# EAGLE design LE1-4 (EAGLE 8.5.1)
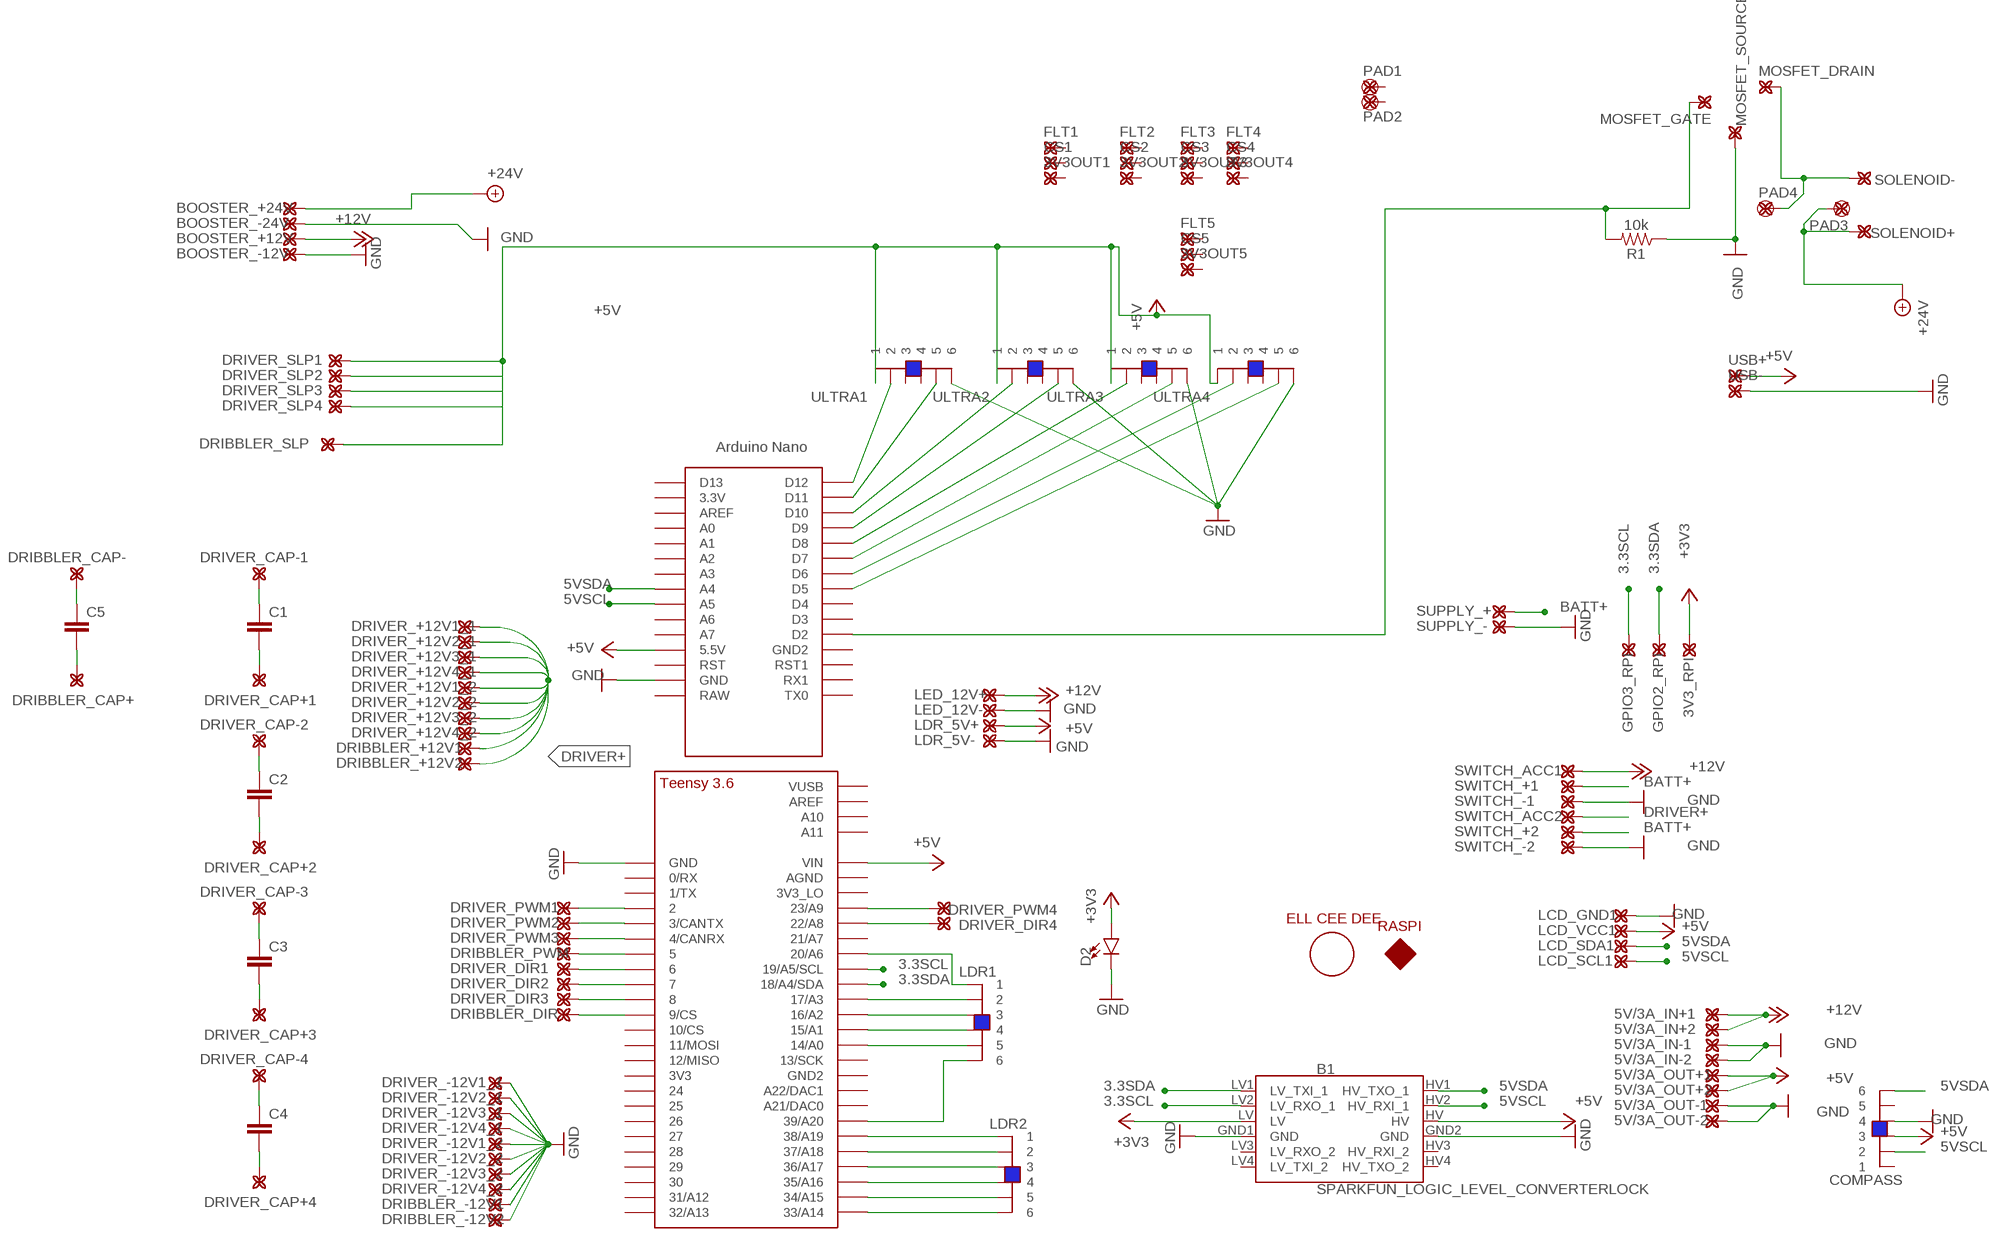
[diagram p0: schematic, sheet 1]

## Parts
3V3_RPI  BETTERPAD_2.54  [SUPERIORSIM]
3V3OUT1  BETTERPAD_2.54  [SUPERIORSIM]
3V3OUT2  BETTERPAD_2.54  [SUPERIORSIM]
3V3OUT3  BETTERPAD_2.54  [SUPERIORSIM]
3V3OUT4  BETTERPAD_2.54  [SUPERIORSIM]
3V3OUT5  BETTERPAD_2.54  [SUPERIORSIM]
5V/3A_IN+1  BETTERPAD_2.54  [SUPERIORSIM]
5V/3A_IN+2  BETTERPAD_2.54  [SUPERIORSIM]
5V/3A_IN-1  BETTERPAD_2.54  [SUPERIORSIM]
5V/3A_IN-2  BETTERPAD_2.54  [SUPERIORSIM]
5V/3A_OUT+1  BETTERPAD_2.54  [SUPERIORSIM]
5V/3A_OUT+2  BETTERPAD_2.54  [SUPERIORSIM]
5V/3A_OUT-1  BETTERPAD_2.54  [SUPERIORSIM]
5V/3A_OUT-2  BETTERPAD_2.54  [SUPERIORSIM]
B1  SPARKFUN_LOGIC_LEVEL_CONVERTERLOCK  [SPARKFUN_LOGIC_LEVEL_CONVERTER_LOCK]
BOOSTER_+12V  BETTERPAD_2.54  [SUPERIORSIM]
BOOSTER_+24V  BETTERPAD_2.54  [SUPERIORSIM]
BOOSTER_-12V  BETTERPAD_2.54  [SUPERIORSIM]
BOOSTER_-24V  BETTERPAD_2.54  [SUPERIORSIM]
C1  C5/7.2  [C5B7.2]
C2  C5/7.2  [C5B7.2]
C3  C5/7.2  [C5B7.2]
C4  C5/7.2  [C5B7.2]
C5  C5/7.2  [C5B7.2]
COMPASS  6P6C_FEMALESMD  [6P6C_FEMALE]
CS1  BETTERPAD_2.54  [SUPERIORSIM]
CS2  BETTERPAD_2.54  [SUPERIORSIM]
CS3  BETTERPAD_2.54  [SUPERIORSIM]
CS4  BETTERPAD_2.54  [SUPERIORSIM]
CS5  BETTERPAD_2.54  [SUPERIORSIM]
D2  LED-3MM-NO_SILK  [LED_3MM-NS]
DRIBBLER_+12V1  BETTERPAD_2.54  [SUPERIORSIM]
DRIBBLER_+12V2  BETTERPAD_2.54  [SUPERIORSIM]
DRIBBLER_-12V1  BETTERPAD_2.54  [SUPERIORSIM]
DRIBBLER_-12V2  BETTERPAD_2.54  [SUPERIORSIM]
DRIBBLER_CAP+  BETTERPAD_2.54  [SUPERIORSIM]
DRIBBLER_CAP-  BETTERPAD_2.54  [SUPERIORSIM]
DRIBBLER_DIR  BETTERPAD_2.54  [SUPERIORSIM]
DRIBBLER_PWM  BETTERPAD_2.54  [SUPERIORSIM]
DRIBBLER_SLP  BETTERPAD_2.54  [SUPERIORSIM]
DRIVER_+12V1_1  BETTERPAD_2.54  [SUPERIORSIM]
DRIVER_+12V1_2  BETTERPAD_2.54  [SUPERIORSIM]
DRIVER_+12V2_1  BETTERPAD_2.54  [SUPERIORSIM]
DRIVER_+12V2_2  BETTERPAD_2.54  [SUPERIORSIM]
DRIVER_+12V3_1  BETTERPAD_2.54  [SUPERIORSIM]
DRIVER_+12V3_2  BETTERPAD_2.54  [SUPERIORSIM]
DRIVER_+12V4_1  BETTERPAD_2.54  [SUPERIORSIM]
DRIVER_+12V4_2  BETTERPAD_2.54  [SUPERIORSIM]
DRIVER_-12V1_1  BETTERPAD_2.54  [SUPERIORSIM]
DRIVER_-12V1_2  BETTERPAD_2.54  [SUPERIORSIM]
DRIVER_-12V2_1  BETTERPAD_2.54  [SUPERIORSIM]
DRIVER_-12V2_2  BETTERPAD_2.54  [SUPERIORSIM]
DRIVER_-12V3_1  BETTERPAD_2.54  [SUPERIORSIM]
DRIVER_-12V3_2  BETTERPAD_2.54  [SUPERIORSIM]
DRIVER_-12V4_1  BETTERPAD_2.54  [SUPERIORSIM]
DRIVER_-12V4_2  BETTERPAD_2.54  [SUPERIORSIM]
DRIVER_CAP+1  BETTERPAD_2.54  [SUPERIORSIM]
DRIVER_CAP+2  BETTERPAD_2.54  [SUPERIORSIM]
DRIVER_CAP+3  BETTERPAD_2.54  [SUPERIORSIM]
DRIVER_CAP+4  BETTERPAD_2.54  [SUPERIORSIM]
DRIVER_CAP-1  BETTERPAD_2.54  [SUPERIORSIM]
DRIVER_CAP-2  BETTERPAD_2.54  [SUPERIORSIM]
DRIVER_CAP-3  BETTERPAD_2.54  [SUPERIORSIM]
DRIVER_CAP-4  BETTERPAD_2.54  [SUPERIORSIM]
DRIVER_DIR1  BETTERPAD_2.54  [SUPERIORSIM]
DRIVER_DIR2  BETTERPAD_2.54  [SUPERIORSIM]
DRIVER_DIR3  BETTERPAD_2.54  [SUPERIORSIM]
DRIVER_DIR4  BETTERPAD_2.54  [SUPERIORSIM]
DRIVER_PWM1  BETTERPAD_2.54  [SUPERIORSIM]
DRIVER_PWM2  BETTERPAD_2.54  [SUPERIORSIM]
DRIVER_PWM3  BETTERPAD_2.54  [SUPERIORSIM]
DRIVER_PWM4  BETTERPAD_2.54  [SUPERIORSIM]
DRIVER_SLP1  BETTERPAD_2.54  [SUPERIORSIM]
DRIVER_SLP2  BETTERPAD_2.54  [SUPERIORSIM]
DRIVER_SLP3  BETTERPAD_2.54  [SUPERIORSIM]
DRIVER_SLP4  BETTERPAD_2.54  [SUPERIORSIM]
FLT1  BETTERPAD_2.54  [SUPERIORSIM]
FLT2  BETTERPAD_2.54  [SUPERIORSIM]
FLT3  BETTERPAD_2.54  [SUPERIORSIM]
FLT4  BETTERPAD_2.54  [SUPERIORSIM]
FLT5  BETTERPAD_2.54  [SUPERIORSIM]
GPIO2_RPI  BETTERPAD_2.54  [SUPERIORSIM]
GPIO3_RPI  BETTERPAD_2.54  [SUPERIORSIM]
LCD1  LCD-16X2SILK  [LCD-16X2]
LCD_GND1  BETTERPAD_2.54  [SUPERIORSIM]
LCD_SCL1  BETTERPAD_2.54  [SUPERIORSIM]
LCD_SDA1  BETTERPAD_2.54  [SUPERIORSIM]
LCD_VCC1  BETTERPAD_2.54  [SUPERIORSIM]
LDR1  6P6C_FEMALESMD  [6P6C_FEMALE]
LDR2  6P6C_FEMALESMD  [6P6C_FEMALE]
LDR_5V+  BETTERPAD_2.54  [SUPERIORSIM]
LDR_5V-  BETTERPAD_2.54  [SUPERIORSIM]
LED_12V+  BETTERPAD_2.54  [SUPERIORSIM]
LED_12V-  BETTERPAD_2.54  [SUPERIORSIM]
MOSFET_DRAIN  BETTERPAD_2.54  [SUPERIORSIM]
MOSFET_GATE  BETTERPAD_2.54  [SUPERIORSIM]
MOSFET_SOURCE  BETTERPAD_2.54  [SUPERIORSIM]
PAD1  BETTERPAD_2.54/1.5  [1,5]
PAD2  BETTERPAD_2.54/1.5  [1,5]
PAD3  BETTERPAD_2.54/1.5  [1,5]
PAD4  BETTERPAD_2.54/1.5  [1,5]
PCB1  RPI3  [RPI3]
R1  10k  10KOHM-HORIZ-1/4W-1%  [AXIAL-0.3]
SOLENOID+  BETTERPAD_2.54  [SUPERIORSIM]
SOLENOID-  BETTERPAD_2.54  [SUPERIORSIM]
SUPPLY_+  BETTERPAD_2.54  [SUPERIORSIM]
SUPPLY_-  BETTERPAD_2.54  [SUPERIORSIM]
SWITCH_+1  BETTERPAD_2.54  [SUPERIORSIM]
SWITCH_+2  BETTERPAD_2.54  [SUPERIORSIM]
SWITCH_-1  BETTERPAD_2.54  [SUPERIORSIM]
SWITCH_-2  BETTERPAD_2.54  [SUPERIORSIM]
SWITCH_ACC1  BETTERPAD_2.54  [SUPERIORSIM]
SWITCH_ACC2  BETTERPAD_2.54  [SUPERIORSIM]
U$1  TEENSY_3.5/3.6_BASIC  [TEENSY_3.5/3.6_BASIC]
U$2  NANO  [NANO]
ULTRA1  6P6C_FEMALESMD  [6P6C_FEMALE]
ULTRA2  6P6C_FEMALESMD  [6P6C_FEMALE]
ULTRA3  6P6C_FEMALESMD  [6P6C_FEMALE]
ULTRA4  6P6C_FEMALESMD  [6P6C_FEMALE]
USB+  BETTERPAD_2.54  [SUPERIORSIM]
USB-  BETTERPAD_2.54  [SUPERIORSIM]

## Nets
3.3SCL: B1.LV2(LV_RXO_1) GPIO3_RPI..(P) U$1.19/A5/SCL
3.3SDA: B1.LV1(LV_TXI_1) GPIO2_RPI..(P) U$1.18/A4/SDA
5VSCL: B1.HV2(HV_RXI_1) COMPASS.2 LCD_SCL1..(P) U$2.A5
5VSDA: B1.HV1(HV_TXO_1) COMPASS.6 LCD_SDA1..(P) U$2.A4
+3V3: 3V3_RPI..(P) B1.LV D2.A
+5V: 5V/3A_OUT+1..(P) 5V/3A_OUT+2..(P) B1.HV COMPASS.3 DRIBBLER_SLP..(P) DRIVER_SLP1..(P) DRIVER_SLP2..(P) DRIVER_SLP3..(P) DRIVER_SLP4..(P) LCD_VCC1..(P) LDR_5V+..(P) U$1.VIN U$2.5V(5.5V) ULTRA1.1 ULTRA2.1 ULTRA3.1 ULTRA4.1 USB+..(P)
+12V: 5V/3A_IN+1..(P) 5V/3A_IN+2..(P) BOOSTER_+12V..(P) LED_12V+..(P) SWITCH_ACC1..(P)
+24V: BOOSTER_+24V..(P) PAD3.P$1(P) SOLENOID+..(P)
BATT+: SUPPLY_+..(P) SWITCH_+1..(P) SWITCH_+2..(P)
DRIVER+: DRIBBLER_+12V1..(P) DRIBBLER_+12V2..(P) DRIVER_+12V1_1..(P) DRIVER_+12V1_2..(P) DRIVER_+12V2_1..(P) DRIVER_+12V2_2..(P) DRIVER_+12V3_1..(P) DRIVER_+12V3_2..(P) DRIVER_+12V4_1..(P) DRIVER_+12V4_2..(P) SWITCH_ACC2..(P)
GND: 5V/3A_IN-1..(P) 5V/3A_IN-2..(P) 5V/3A_OUT-1..(P) 5V/3A_OUT-2..(P) B1.GND1(GND) B1.GND2(GND) BOOSTER_-12V..(P) BOOSTER_-24V..(P) COMPASS.4 D2.K(C) DRIBBLER_-12V1..(P) DRIBBLER_-12V2..(P) DRIVER_-12V1_1..(P) DRIVER_-12V1_2..(P) DRIVER_-12V2_1..(P) DRIVER_-12V2_2..(P) DRIVER_-12V3_1..(P) DRIVER_-12V3_2..(P) DRIVER_-12V4_1..(P) DRIVER_-12V4_2..(P) LCD_GND1..(P) LDR_5V-..(P) LED_12V-..(P) MOSFET_SOURCE..(P) R1.P$1 SUPPLY_-..(P) SWITCH_-1..(P) SWITCH_-2..(P) U$1.GND U$2.GND ULTRA1.6 ULTRA2.6 ULTRA3.6 ULTRA4.6 USB-..(P)
N$1: LDR1.6 U$1.39/A20
N$2: DRIBBLER_DIR..(P) U$1.9/CS
N$3: DRIBBLER_PWM..(P) U$1.5
N$4: DRIVER_PWM1..(P) U$1.2
N$5: DRIVER_PWM2..(P) U$1.3/CANTX
N$6: LDR1.2 U$1.17/A3
N$7: LDR1.3 U$1.16/A2
N$8: LDR1.4 U$1.15/A1
N$9: LDR1.5 U$1.14/A0
N$10: LDR1.1 U$1.20/A6
N$11: DRIVER_PWM3..(P) U$1.4/CANRX
N$12: MOSFET_DRAIN..(P) PAD4.P$1(P) SOLENOID-..(P)
N$13: MOSFET_GATE..(P) R1.P$2 U$2.D2
N$14: DRIVER_PWM4..(P) U$1.23/A9
N$15: DRIVER_DIR4..(P) U$1.22/A8
N$16: C5.1 DRIBBLER_CAP-..(P)
N$17: DRIVER_DIR1..(P) U$1.6
N$18: LDR2.1 U$1.38/A19
N$19: LDR2.2 U$1.37/A18
N$20: LDR2.3 U$1.36/A17
N$21: LDR2.4 U$1.35/A16
N$22: LDR2.5 U$1.34/A15
N$23: LDR2.6 U$1.33/A14
N$24: DRIVER_DIR2..(P) U$1.7
N$25: DRIVER_DIR3..(P) U$1.8
N$26: U$2.D12 ULTRA1.2
N$27: C5.2 DRIBBLER_CAP+..(P)
N$28: U$2.D11 ULTRA1.5
N$29: U$2.D10 ULTRA2.2
N$30: U$2.D9 ULTRA2.5
N$31: C1.1 DRIVER_CAP-1..(P)
N$32: C1.2 DRIVER_CAP+1..(P)
N$33: C2.1 DRIVER_CAP-2..(P)
N$34: C2.2 DRIVER_CAP+2..(P)
N$35: C3.1 DRIVER_CAP-3..(P)
N$36: C3.2 DRIVER_CAP+3..(P)
N$37: C4.1 DRIVER_CAP-4..(P)
N$38: C4.2 DRIVER_CAP+4..(P)
N$39: U$2.D8 ULTRA3.2
N$40: U$2.D7 ULTRA3.5
N$41: U$2.D6 ULTRA4.2
N$42: U$2.D5 ULTRA4.5
Unconnected: 3V3OUT1..(P) 3V3OUT2..(P) 3V3OUT3..(P) 3V3OUT4..(P) 3V3OUT5..(P) B1.HV3(HV_RXI_2) B1.HV4(HV_TXO_2) B1.LV3(LV_RXO_2) B1.LV4(LV_TXI_2) COMPASS.1 COMPASS.5 CS1..(P) CS2..(P) CS3..(P) CS4..(P) CS5..(P) FLT1..(P) FLT2..(P) FLT3..(P) FLT4..(P) FLT5..(P) PAD1.P$1(P) PAD2.P$1(P) U$1.0/RX U$1.1/TX U$1.3V3 U$1.3V3_LO U$1.10/CS U$1.11/MOSI U$1.12/MISO U$1.13/SCK U$1.21/A7 U$1.21/DAC0(A21/DAC0) U$1.24 U$1.25 U$1.26 U$1.27 U$1.28 U$1.29 U$1.30 U$1.31/A12 U$1.32/A13 U$1.A10 U$1.A11 U$1.A22/DAC1 U$1.AGND U$1.AREF U$1.GND2 U$1.VUSB U$2.3.3V U$2.A0 U$2.A1 U$2.A2 U$2.A3 U$2.A6 U$2.A7 U$2.AREF U$2.D3 U$2.D4 U$2.D13 U$2.GND1(GND2) U$2.RAW U$2.RST U$2.RST1 U$2.RX1 U$2.TX0 ULTRA1.3 ULTRA1.4 ULTRA2.3 ULTRA2.4 ULTRA3.3 ULTRA3.4 ULTRA4.3 ULTRA4.4

## Library data of the parts
3V3_RPI 3V3OUT1-3V3OUT5 5V/3A_IN+1 5V/3A_IN+2 5V/3A_IN-1 5V/3A_IN-2 5V/3A_OUT+1 5V/3A_OUT+2 5V/3A_OUT-1 5V/3A_OUT-2 BOOSTER_+12V BOOSTER_+24V BOOSTER_-12V BOOSTER_-24V CS1-CS5 DRIBBLER_+12V1 DRIBBLER_+12V2 DRIBBLER_-12V1 DRIBBLER_-12V2 DRIBBLER_CAP+ DRIBBLER_CAP- DRIBBLER_DIR DRIBBLER_PWM DRIBBLER_SLP DRIVER_+12V1_1 DRIVER_+12V1_2 DRIVER_+12V2_1 DRIVER_+12V2_2 DRIVER_+12V3_1 DRIVER_+12V3_2 DRIVER_+12V4_1 DRIVER_+12V4_2 DRIVER_-12V1_1 DRIVER_-12V1_2 DRIVER_-12V2_1 DRIVER_-12V2_2 DRIVER_-12V3_1 DRIVER_-12V3_2 DRIVER_-12V4_1 DRIVER_-12V4_2 DRIVER_CAP+1-DRIVER_CAP+4 DRIVER_CAP-1-DRIVER_CAP-4 DRIVER_DIR1-DRIVER_DIR4 DRIVER_PWM1-DRIVER_PWM4 DRIVER_SLP1-DRIVER_SLP4 FLT1-FLT5 GPIO2_RPI GPIO3_RPI LCD_GND1 LCD_SCL1 LCD_SDA1 LCD_VCC1 LDR_5V+ LDR_5V- LED_12V+ LED_12V- MOSFET_DRAIN MOSFET_GATE MOSFET_SOURCE SOLENOID+ SOLENOID- SUPPLY_+ SUPPLY_- SWITCH_+1 SWITCH_+2 SWITCH_-1 SWITCH_-2 SWITCH_ACC1 SWITCH_ACC2 USB+ USB- = Yijiano:BETTERPAD_2.54
B1 = SparkFun-Boards:SPARKFUN_LOGIC_LEVEL_CONVERTER: SparkFun Logic Level Converter -Bi-Directional This is the mechnical outline for the 3.3V - 5V bi directional logic level converter. *Note, the "LOCK" Package has the header pins staggered by an offset of 5 mils (off center line), so that when you slide a row of standard 0.1" headers into the PTH pads, it will hold position vertically. See the follwing turorial for more information on this type of special footprints: Sneaky Footprints <https://www.sparkfun.com/tutorials/114> SparkFun Products: SparkFun Logic Level Converter - Bi-Directional <https://www.sparkfun.com/products/12009>
C1-C5 = capacitor-wima:C: CAPACITOR naming: grid - package width
COMPASS LDR1 LDR2 ULTRA1-ULTRA4 = Yijiano:6P6C_FEMALE
D2 = SparkFun-LED:LED: LED (Generic) Standard schematic elements and footprints for 5mm, 3mm, 1206, and 0603 sized LEDs. Generic LEDs with no color specified.
LCD1 = SparkFun-Displays:LCD-16X2: Standard text-only 16x2 parallel input LCD Basic 16 character by 2 line display. Typically utilizes the extremely common HD44780 parallel interface chipset SparkFun Products: Basic 16x2 Green <https://www.sparkfun.com/products/255> Basic 8x2 Green <https://www.sparkfun.com/products/11122>; SF_ID: LCD-00255
PAD1-PAD4 = Yijiano:BETTERPAD_2.54/1.5
PCB1 = e14_Rpi3_RevA:RPI3: Device for Raspberry Pi 3 board created by Dave Young for www.element14.com More information and support community is available at https://www.element14.com/community/community/raspberry-pi
R1 = SparkFun-Resistors:10KOHM: 10kΩ resistor A resistor is a passive two-terminal electrical component that implements electrical resistance as a circuit element. Resistors act to reduce current flow, and, at the same time, act to lower voltage levels within circuits. - Wikipedia; PROD_ID: RES-12183
U$1 = Teensy356:TEENSY_3.5/3.6_BASIC
U$2 = Arduino-clone:NANO: Arduino Nano

## Board
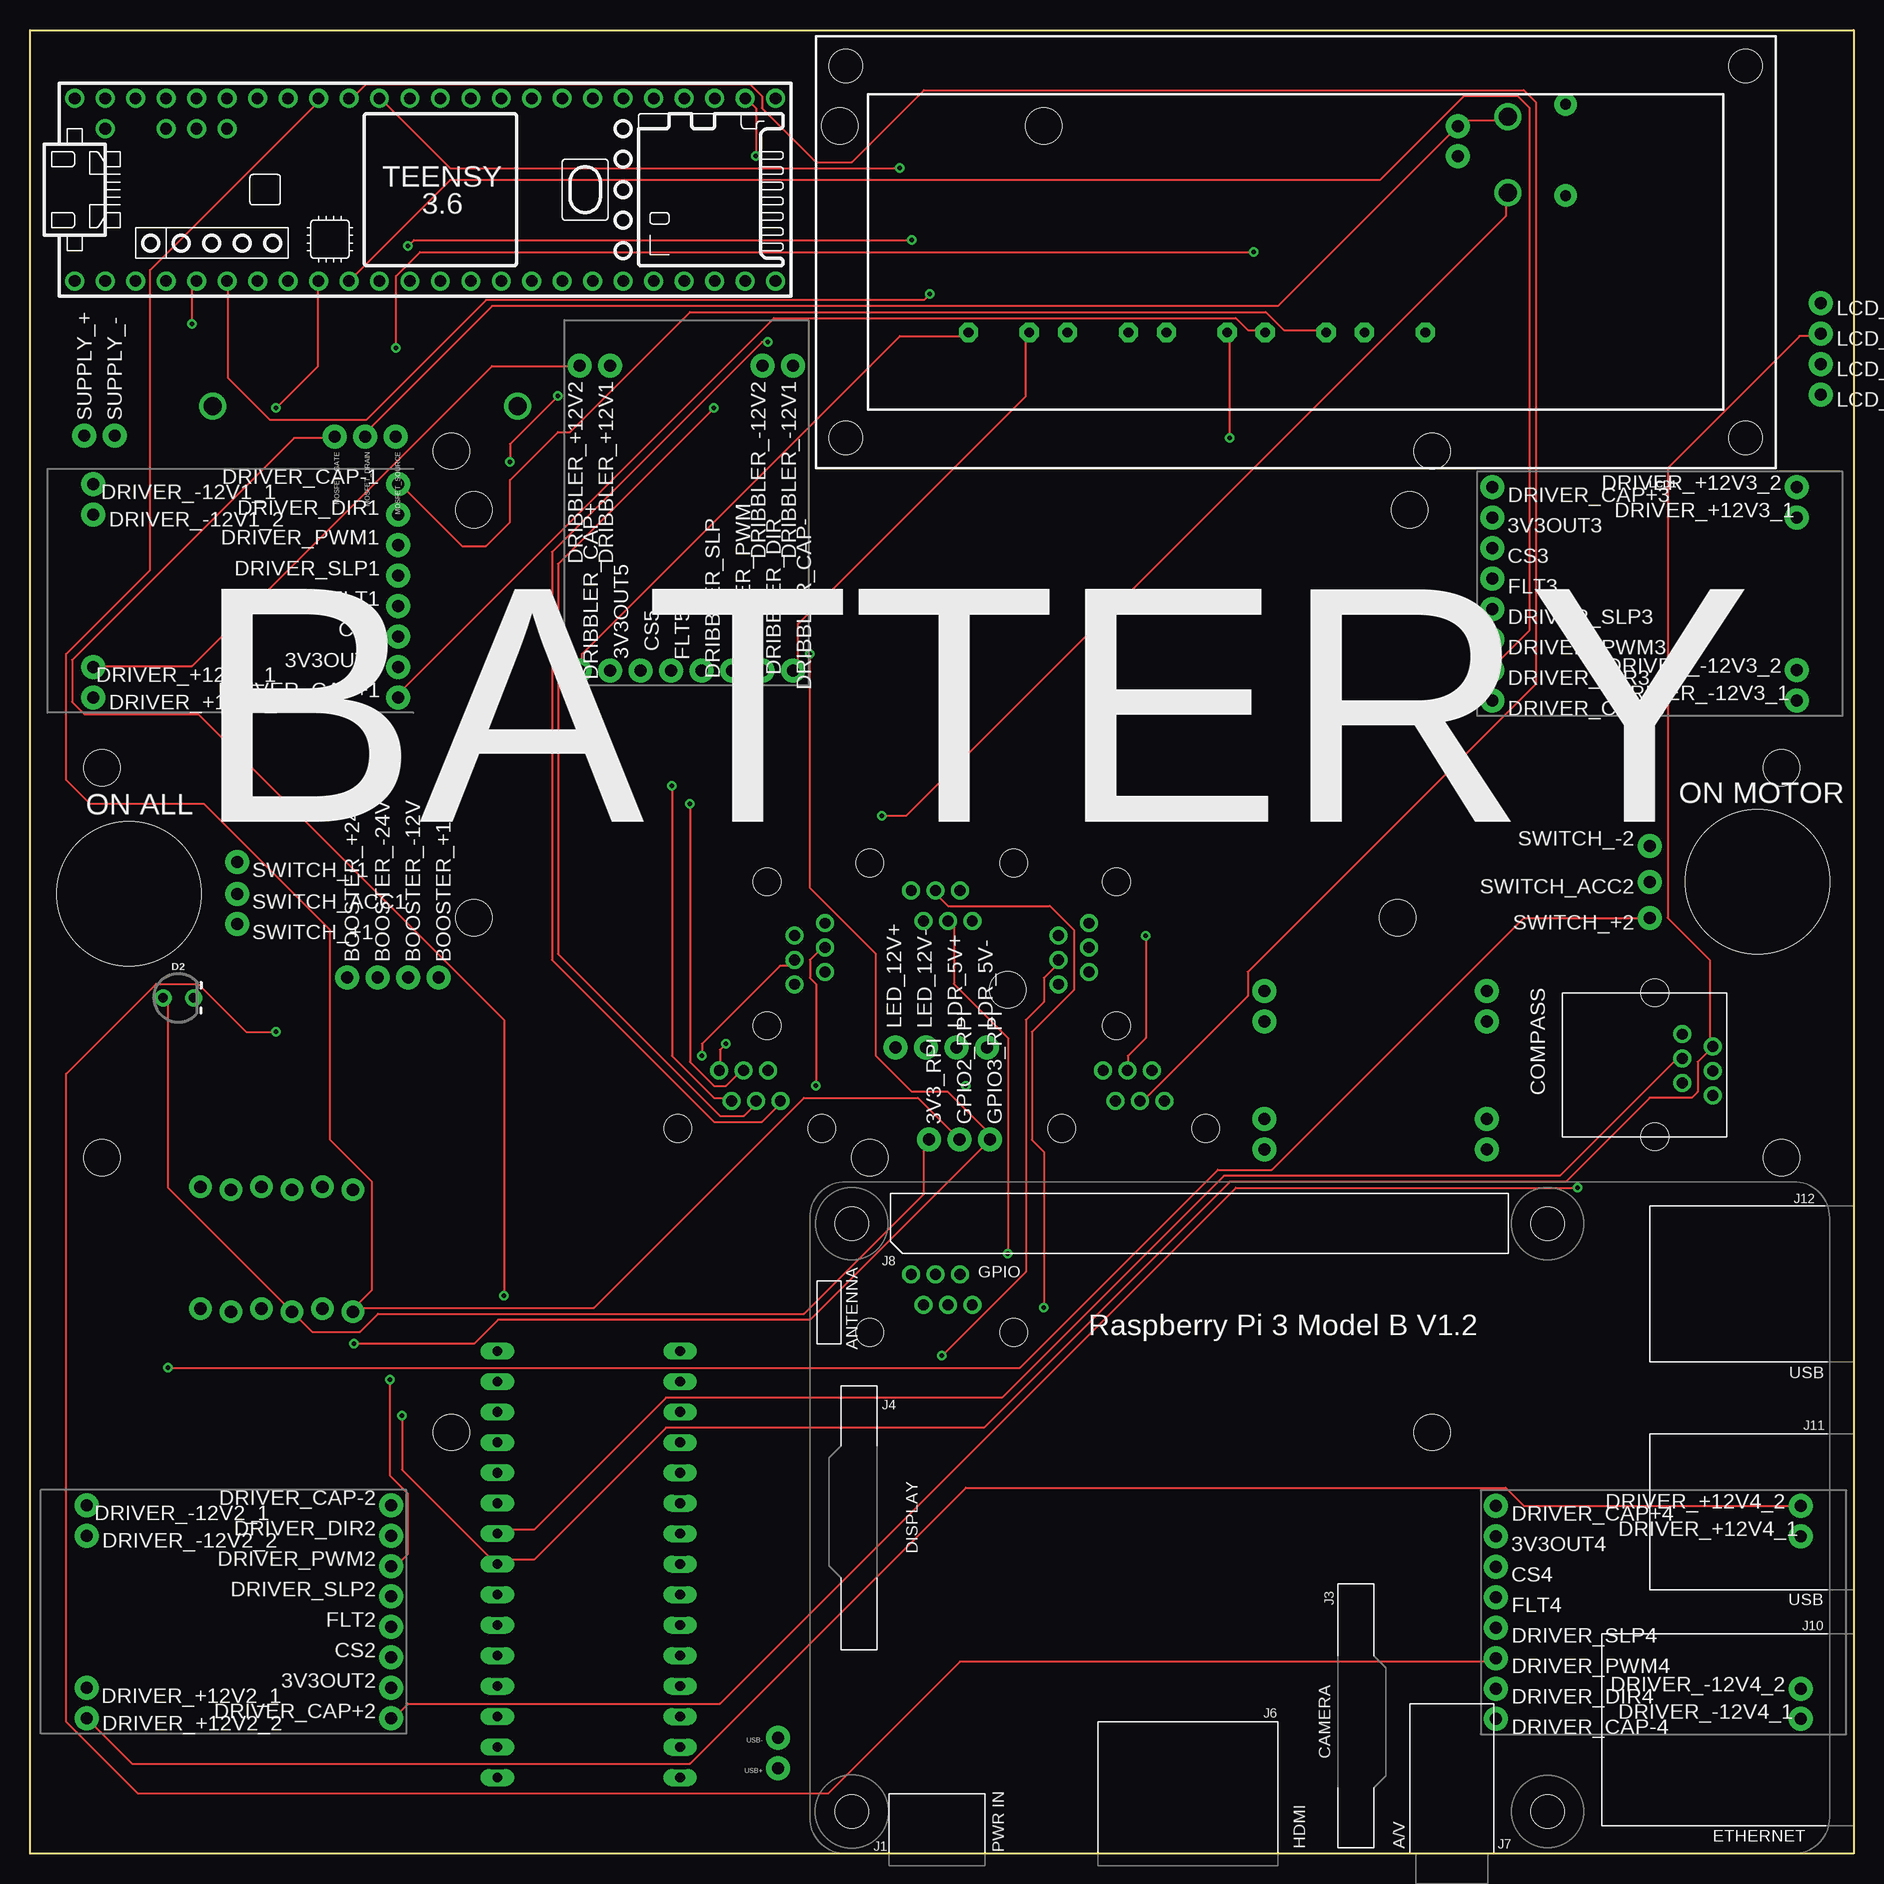
[diagram p1: board, top side]
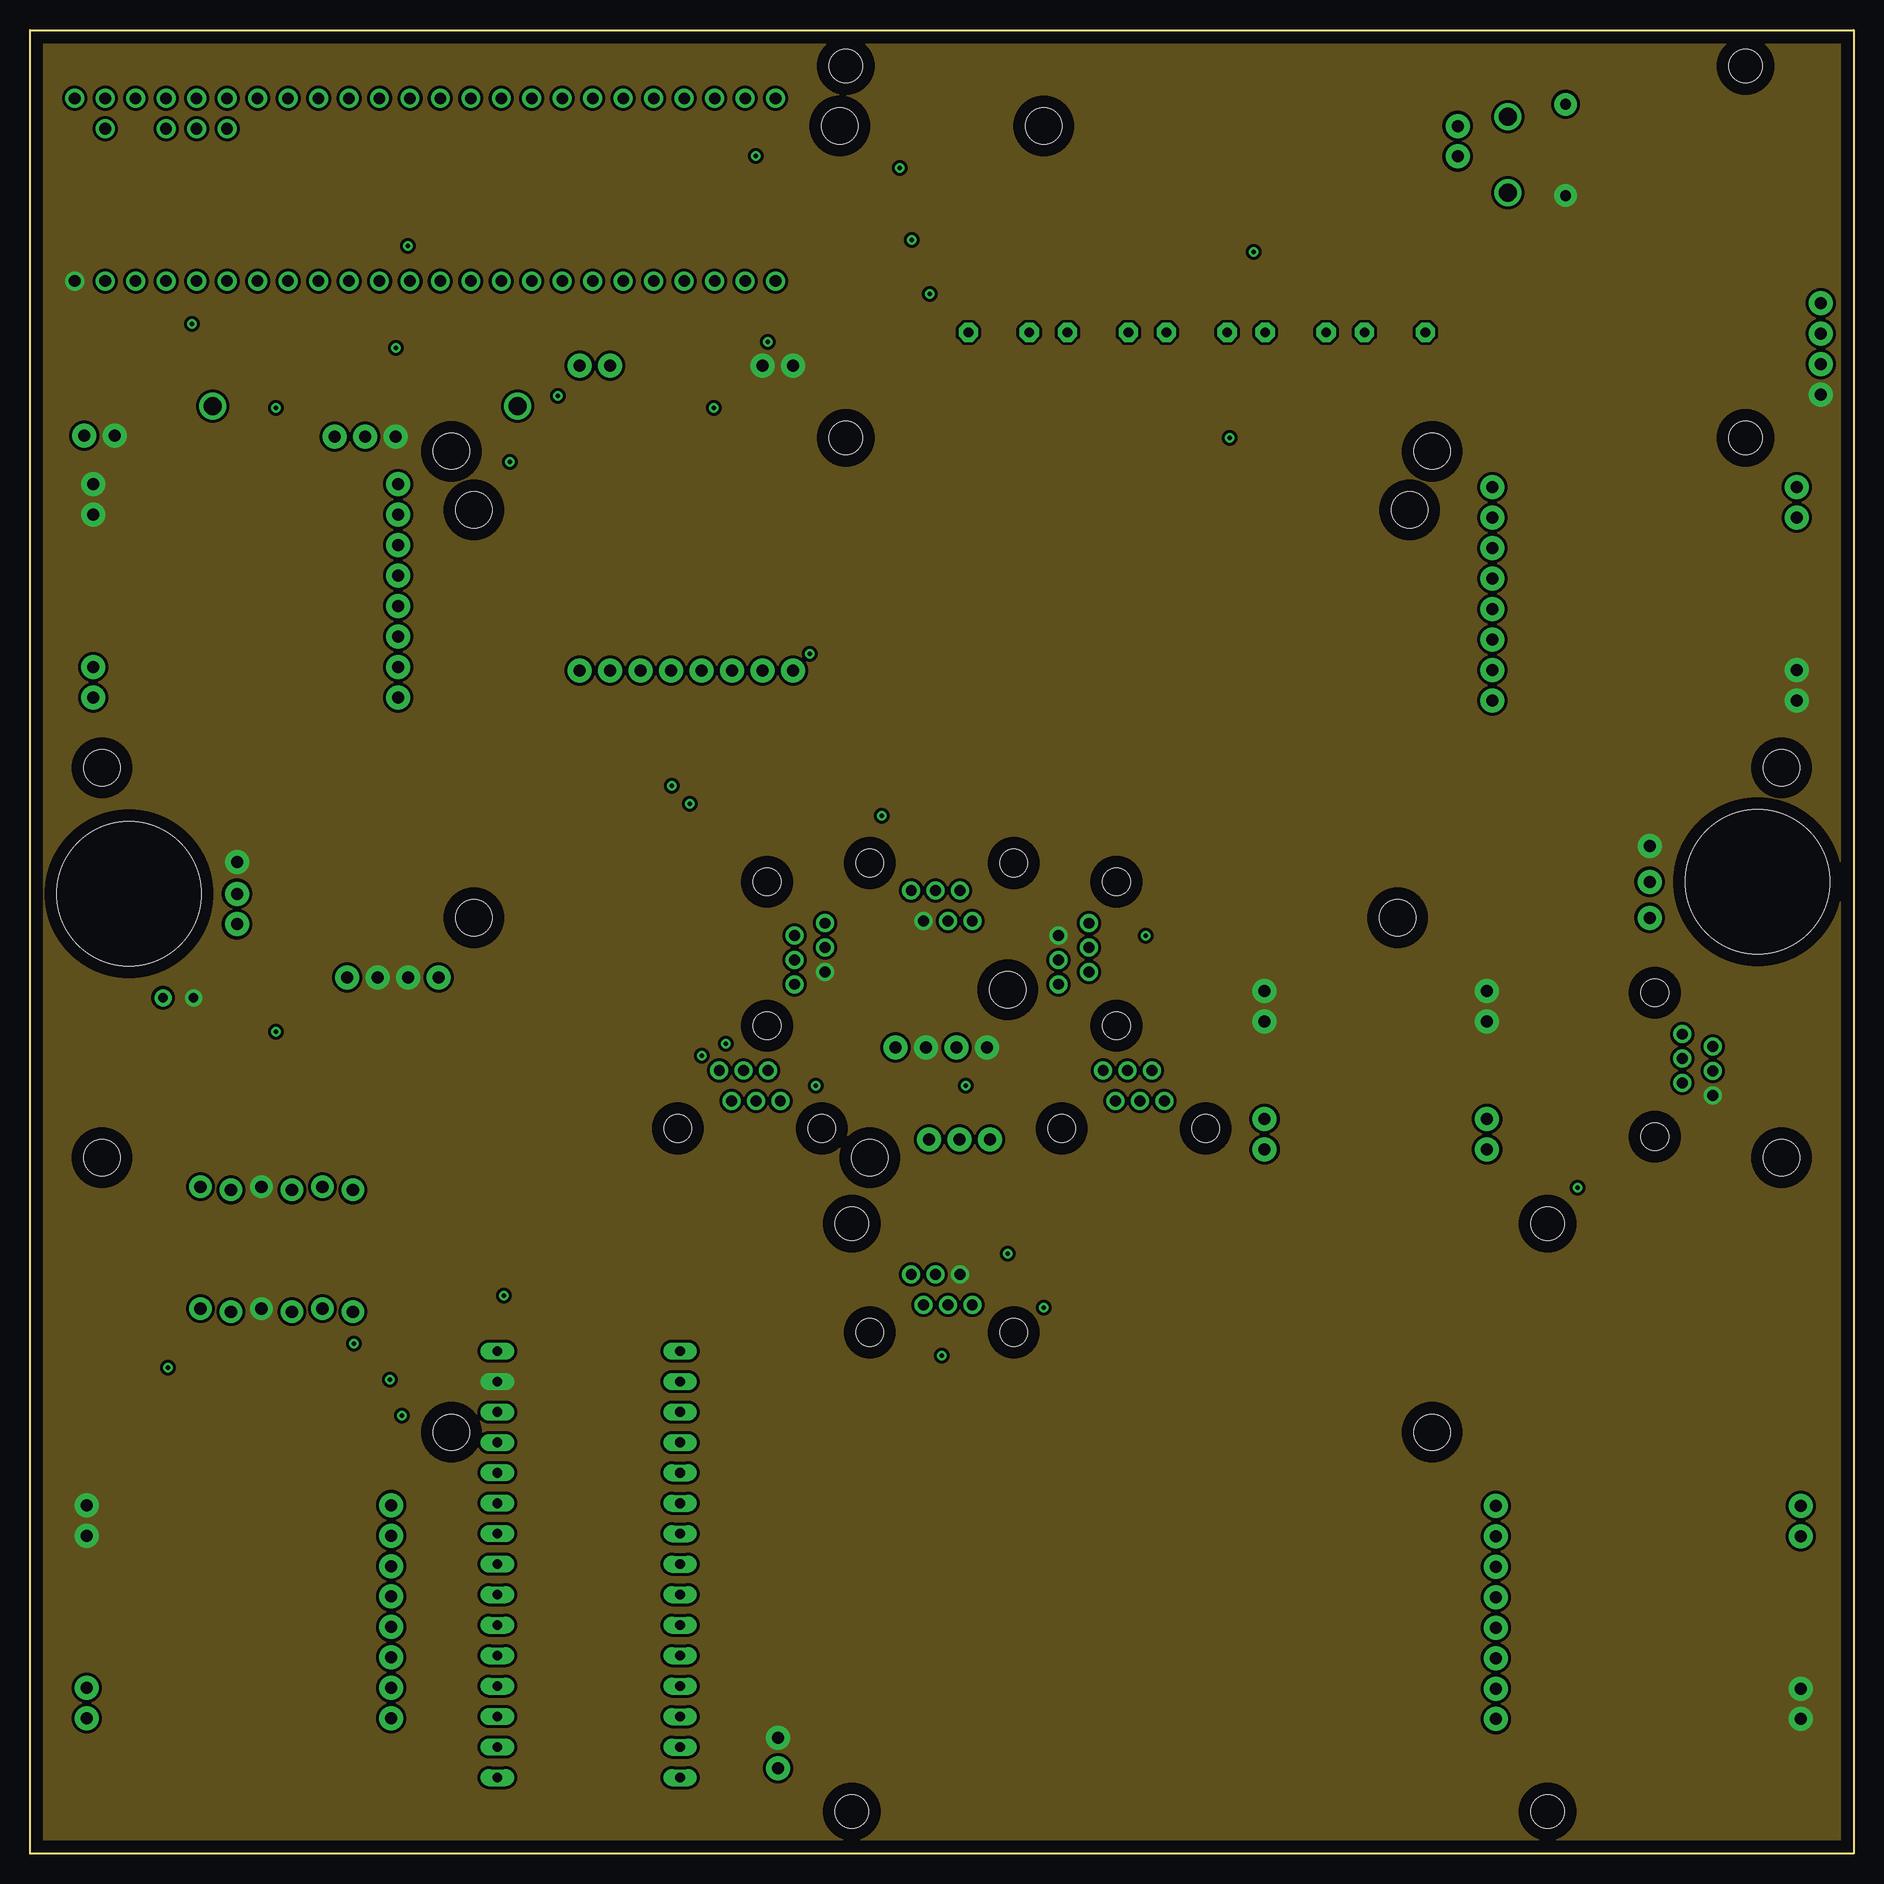
[diagram p2: board, inner layer Route2]
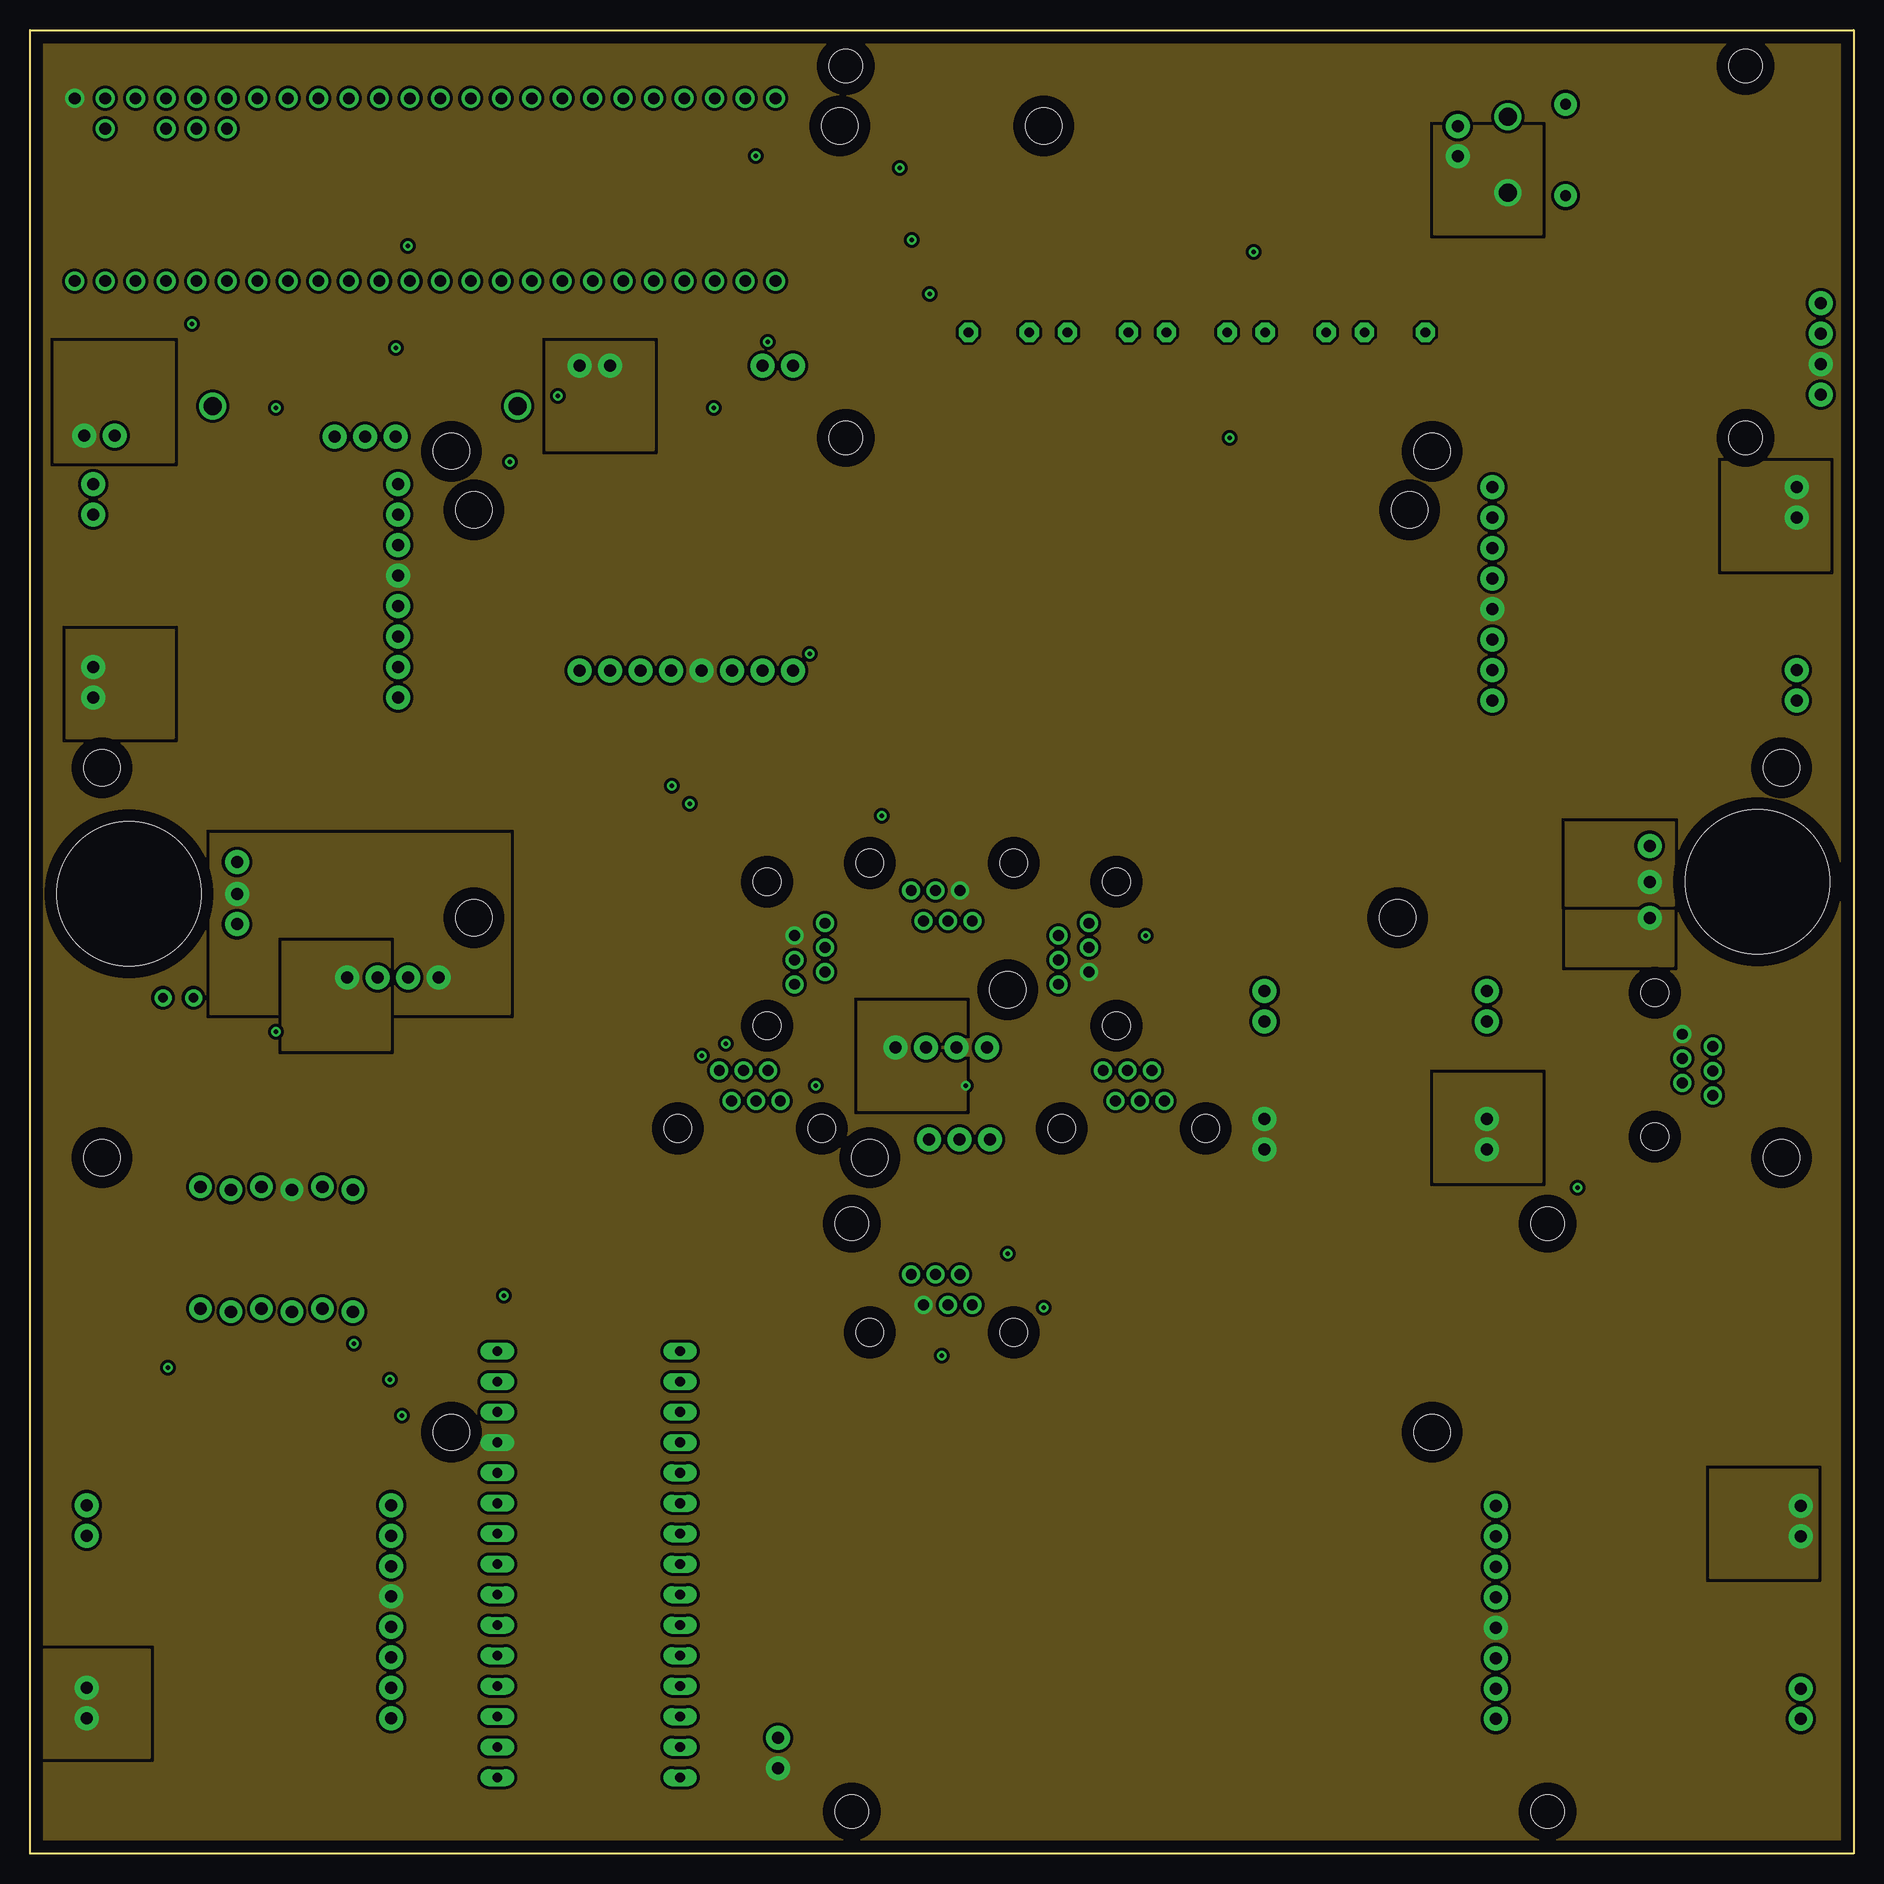
[diagram p3: board, inner layer Route3]
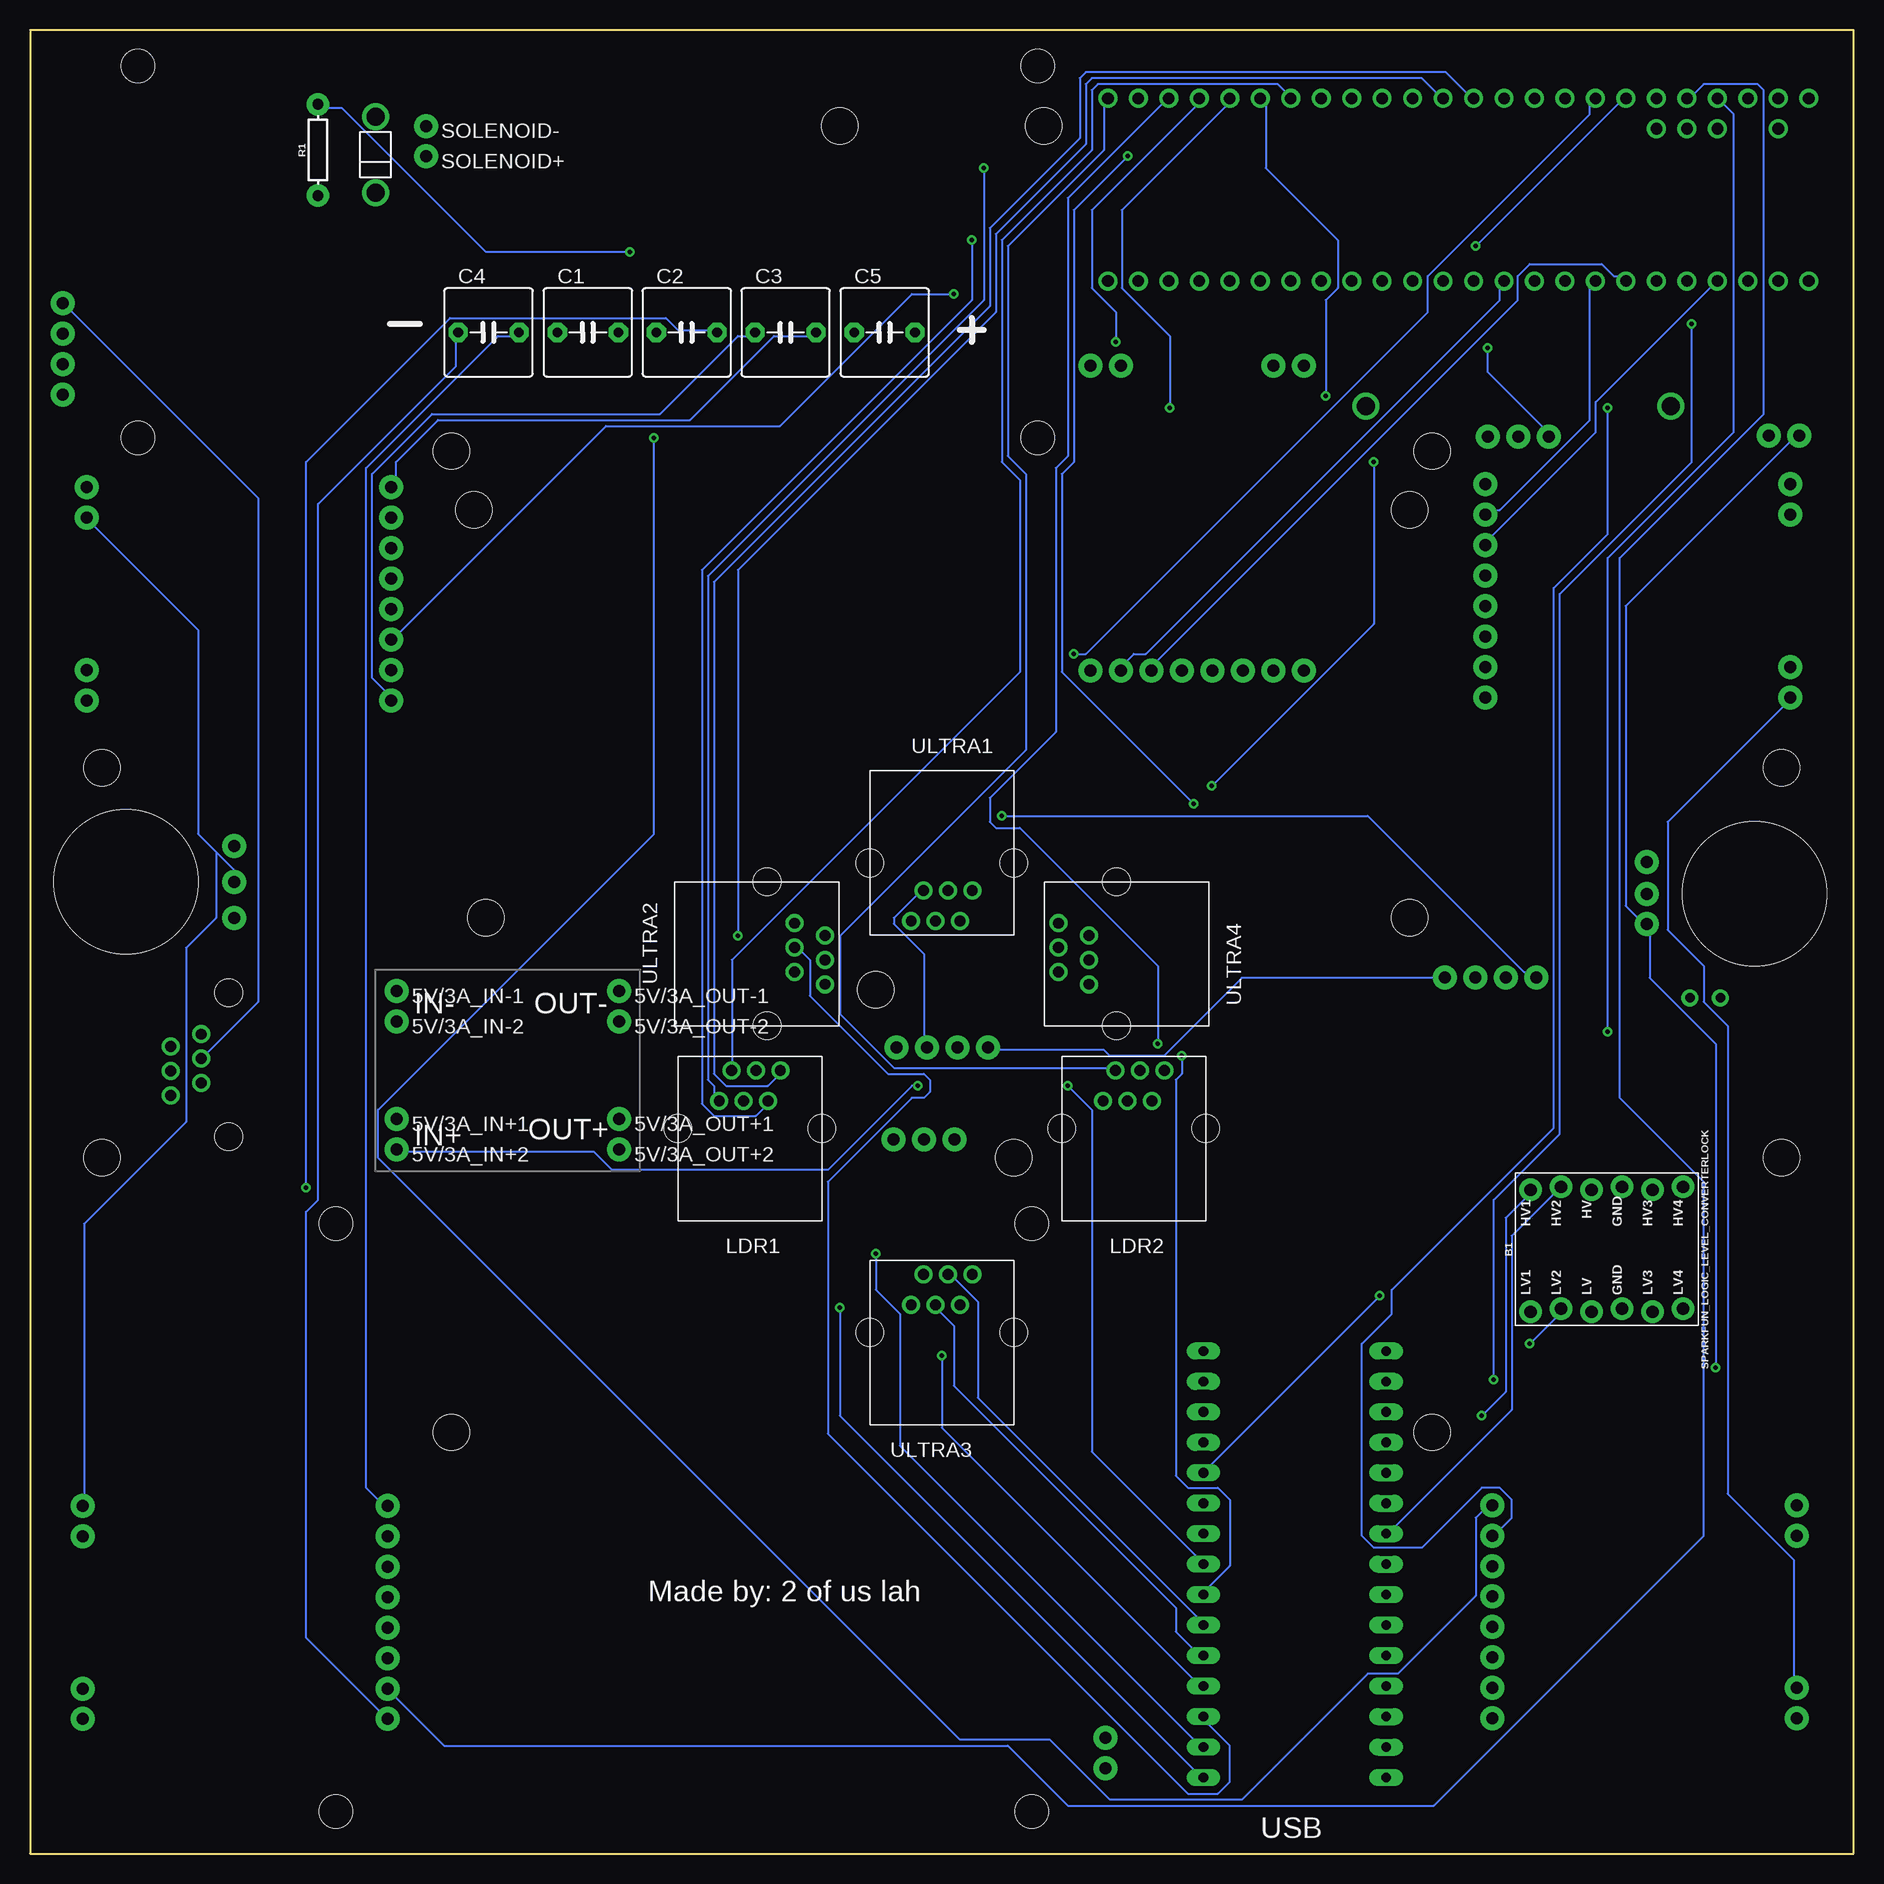
[diagram p4: board, bottom side, seen from below]

Size 152 x 152 mm. Coordinates in mm from the lower left corner, seen from the top.
Outline: 0,152 152,152 152,0 0,0 0,152
Copper layers (1+2*3+16): Top 0.035mm / dielectric 0.486mm / Route2 0.035mm / dielectric 0.487mm / Route3 0.035mm / dielectric 0.486mm / Bottom 0.035mm
Design rules "default *": minimum track width 6mil, minimum drill 0.35mm, track to track 10mil, track to pad 10mil, pad to pad 10mil, via to via 10mil, smd to smd 10mil, copper to edge 40mil, drill to drill 10mil, minimum pad ring 12mil, minimum via ring 8mil, stop-mask expansion 4mil, vias tented up to drill 25mil, thermal gap 10mil
Holes 12 mm at 8.25,80 144,81
Holes 3 mm at 81.5,72 70,58 114,78 115,112 37,112 37,78 67.5,144 84.5,144 35.12,35.11 35.12,116.89 116.88,116.89 116.88,35.11 6,58 146,90.5 6,90.5 146,58

### Footprints (pad centres in the part's own frame; a part is rotated, then mirrored left to right if it is on the bottom)
SUPERIORSIM = drill 1 pad 2: . 0,0
SPARKFUN_LOGIC_LEVEL_CONVERTER_LOCK = drill 1.016 pad 1.88: GND1 -4.953,-1.27; GND2 5.207,-1.27; HV 4.953,1.27; HV1 4.953,6.35; HV2 5.207,3.81; HV3 4.953,-3.81; HV4 5.207,-6.35; LV -5.207,1.27; LV1 -5.207,6.35; LV2 -4.953,3.81; LV3 -5.207,-3.81; LV4 -4.953,-6.35
C5B7.2 = drill 0.813 pad 1.6 octagon: 1 -2.54,0; 2 2.54,0
6P6C_FEMALE = drill 0.9 pad 1.3: 1 -1.53,1.27; 2 0.51,1.27; 3 2.55,1.27; 4 -2.55,-1.27; 5 -0.51,-1.27; 6 1.53,-1.27 | hole 2.3: -6,3.57; 6,3.57
LED_3MM-NS = drill 0.813: A -1.27,0; K 1.27,0
LCD-16X2 = hole 2.8: -37.5,15.5; -37.5,-15.5; 37.5,15.5; 37.5,-15.5
1,5 = drill 1.5: P$1 0,0
RPI3 = hole 2.75: 3.5,3.5; 61.5,3.5; 3.5,52.5; 61.5,52.5
AXIAL-0.3 = drill 0.9 pad 1.88: P$1 -3.81,0; P$2 3.81,0
TEENSY_3.5/3.6_BASIC = drill 0.965: 0/RX -25.4,-7.62; 1/TX -22.86,-7.62; 2 -20.32,-7.62; 3/CANTX -17.78,-7.62; 3V3 7.62,-7.62; 3V3_LO -22.86,7.62; 4/CANRX -15.24,-7.62; 5 -12.7,-7.62; 6 -10.16,-7.62; 7 -7.62,-7.62; 8 -5.08,-7.62; 9/CS -2.54,-7.62; 10/CS 0,-7.62; 11/MOSI 2.54,-7.62; 12/MISO 5.08,-7.62; 13/SCK 5.08,7.62; 14/A0 2.54,7.62; 15/A1 0,7.62; 16/A2 -2.54,7.62; 17/A3 -5.08,7.62; 18/A4/SDA -7.62,7.62; 19/A5/SCL -10.16,7.62; 20/A6 -12.7,7.62; 21/A7 -15.24,7.62; 21/DAC0 12.7,7.62; 22/A8 -17.78,7.62; 23/A9 -20.32,7.62; 24 10.16,-7.62; 25 12.7,-7.62; 26 15.24,-7.62; 27 17.78,-7.62; 28 20.32,-7.62; 29 22.86,-7.62; 30 25.4,-7.62; 31/A12 27.94,-7.62; 32/A13 30.48,-7.62; 33/A14 30.48,7.62; 34/A15 27.94,7.62; 35/A16 25.4,7.62; 36/A17 22.86,7.62; 37/A18 20.32,7.62; 38/A19 17.78,7.62; 39/A20 15.24,7.62; A10 -17.78,5.08; A11 -15.24,5.08; A22/DAC1 10.16,7.62; AGND -25.4,7.62; AREF -20.32,5.08; GND -27.94,-7.62; GND2 7.62,7.62; VIN -27.94,7.62; VUSB -25.4,5.08
NANO = drill 0.8 long: 3.3V -10.16,24.13; 5V -10.16,-1.27; A0 -10.16,19.05; A1 -10.16,16.51; A2 -10.16,13.97; A3 -10.16,11.43; A4 -10.16,8.89; A5 -10.16,6.35; A6 -10.16,3.81; A7 -10.16,1.27; AREF -10.16,21.59; D2 5.08,1.27; D3 5.08,3.81; D4 5.08,6.35; D5 5.08,8.89; D6 5.08,11.43; D7 5.08,13.97; D8 5.08,16.51; D9 5.08,19.05; D10 5.08,21.59; D11 5.08,24.13; D12 5.08,26.67; D13 -10.16,26.67; GND -10.16,-6.35; GND1 5.08,-1.27; RAW -10.16,-8.89; RST -10.16,-3.81; RST1 5.08,-3.81; RX1 5.08,-6.35; TX0 5.08,-8.89

### Placement (x,y rotation side)
3V3_RPI  74.93,59.52 90 top
3V3OUT1  30.68,98.91 180 top
3V3OUT2  30.12,13.8 180 top
3V3OUT3  121.88,111.36 0 top
3V3OUT4  122.2,26.45 0 top
3V3OUT5  48.37,98.61 270 top
5V/3A_IN+1  121.45,61.22 0 bottom
5V/3A_IN+2  121.45,58.68 0 bottom
5V/3A_IN-1  121.45,71.88 0 bottom
5V/3A_IN-2  121.45,69.34 0 bottom
5V/3A_OUT+1  102.91,61.22 0 bottom
5V/3A_OUT+2  102.91,58.68 0 bottom
5V/3A_OUT-1  102.91,71.88 0 bottom
5V/3A_OUT-2  102.91,69.34 0 bottom
B1  20.56,50.37 90 bottom
BOOSTER_+12V  34.06,73.02 90 top
BOOSTER_+24V  26.44,73.02 90 top
BOOSTER_-12V  31.52,73.02 90 top
BOOSTER_-24V  28.98,73.02 90 top
C1  105.5,126.8 0 bottom
C2  97.26,126.8 0 bottom
C3  89.02,126.8 0 bottom
C4  113.78,126.8 0 bottom
C5  80.76,126.8 0 bottom
COMPASS  139,65.75 90 top
CS1  30.68,101.45 180 top
CS2  30.12,16.34 180 top
CS3  121.88,108.82 0 top
CS4  122.2,23.91 0 top
CS5  50.91,98.61 270 top
D2  12.36,71.33 0 top
DRIBBLER_+12V1  48.37,124.01 270 top
DRIBBLER_+12V2  45.83,124.01 270 top
DRIBBLER_-12V1  63.61,124.01 270 top
DRIBBLER_-12V2  61.07,124.01 270 top
DRIBBLER_CAP+  45.83,98.61 270 top
DRIBBLER_CAP-  63.61,98.61 270 top
DRIBBLER_DIR  61.07,98.61 270 top
DRIBBLER_PWM  58.53,98.61 270 top
DRIBBLER_SLP  55.99,98.61 270 top
DRIVER_+12V1_1  5.28,98.91 180 top
DRIVER_+12V1_2  5.28,96.37 0 top
DRIVER_+12V2_1  4.72,13.8 180 top
DRIVER_+12V2_2  4.72,11.26 0 top
DRIVER_+12V3_1  147.28,111.36 0 top
DRIVER_+12V3_2  147.28,113.9 180 top
DRIVER_+12V4_1  147.6,26.45 0 top
DRIVER_+12V4_2  147.6,28.99 180 top
DRIVER_-12V1_1  5.28,114.15 180 top
DRIVER_-12V1_2  5.28,111.61 0 top
DRIVER_-12V2_1  4.72,29.04 180 top
DRIVER_-12V2_2  4.72,26.5 0 top
DRIVER_-12V3_1  147.28,96.12 0 top
DRIVER_-12V3_2  147.28,98.66 180 top
DRIVER_-12V4_1  147.6,11.21 0 top
DRIVER_-12V4_2  147.6,13.75 180 top
DRIVER_CAP+1  30.68,96.37 180 top
DRIVER_CAP+2  30.12,11.26 180 top
DRIVER_CAP+3  121.88,113.9 0 top
DRIVER_CAP+4  122.2,28.99 0 top
DRIVER_CAP-1  30.68,114.15 180 top
DRIVER_CAP-2  30.12,29.04 180 top
DRIVER_CAP-3  121.88,96.12 0 top
DRIVER_CAP-4  122.2,11.21 0 top
DRIVER_DIR1  30.68,111.61 180 top
DRIVER_DIR2  30.12,26.5 180 top
DRIVER_DIR3  121.88,98.66 0 top
DRIVER_DIR4  122.2,13.75 0 top
DRIVER_PWM1  30.68,109.07 180 top
DRIVER_PWM2  30.12,23.96 180 top
DRIVER_PWM3  121.88,101.2 0 top
DRIVER_PWM4  122.2,16.29 0 top
DRIVER_SLP1  30.68,106.53 180 top
DRIVER_SLP2  30.12,21.42 180 top
DRIVER_SLP3  121.88,103.74 0 top
DRIVER_SLP4  122.2,18.83 0 top
FLT1  30.68,103.99 180 top
FLT2  30.12,18.88 180 top
FLT3  121.88,106.28 0 top
FLT4  122.2,21.37 0 top
FLT5  53.45,98.61 270 top
GPIO2_RPI  77.47,59.52 90 top
GPIO3_RPI  80.01,59.52 90 top
LCD1  105.5,133.5 180 top
LCD_GND1  149.28,121.6 0 top
LCD_SCL1  149.28,129.22 0 top
LCD_SDA1  149.28,126.68 0 top
LCD_VCC1  149.28,124.14 0 top
LDR1  92,64 180 bottom
LDR2  60,64 180 bottom
LDR_5V+  77.22,67.18 90 top
LDR_5V-  79.76,67.18 90 top
LED_12V+  72.14,67.18 90 top
LED_12V-  74.68,67.18 90 top
MOSFET_DRAIN  27.94,118.11 270 top
MOSFET_GATE  25.4,118.11 270 top
MOSFET_SOURCE  30.48,118.11 270 top
PAD1  15.24,120.65 0 top
PAD2  40.64,120.65 0 top
PAD3  123.19,138.43 0 top
PAD4  123.19,144.78 0 top
PCB1  65,0 0 top
R1  128,142 90 bottom
SOLENOID+  119,141.46 0 bottom
SOLENOID-  119,144 0 bottom
SUPPLY_+  4.52,118.18 90 top
SUPPLY_-  7.06,118.18 90 top
SWITCH_+1  17.25,77.46 0 top
SWITCH_+2  135,78 180 top
SWITCH_-1  17.25,82.64 0 top
SWITCH_-2  135,84 180 top
SWITCH_ACC1  17.25,80 0 top
SWITCH_ACC2  135,81 180 top
U$1  31.67,138.69 0 top
U$2  49.11,33 180 bottom
ULTRA1  76,79 0 bottom
ULTRA2  87,75 90 bottom
ULTRA3  76,47 180 bottom
ULTRA4  65,75 270 bottom
USB+  62.37,7.09 180 top
USB-  62.37,9.63 180 top

### Tracks (layer width: path | path; a pad name or v marks a point on that pad's centre or on a via)
3.3SCL  (via drill 0.35)
  Top 0.152: v65,100 65,80.5 70.5,75 70.5,66.5 73.5,63.5 76.5,63.5 80,60 GPIO3_RPI.. 80,59.5 65,44.5 39,44.5 37,42.5 v27,42.5
  Bottom 0.152: v65,100 64,100 35.5,128.5 35.5,131.5 22,145 22,146 U$1.19/A5/SCL | v27,42.5 24.5,45 B1.LV2
3.3SDA
  Top 0.152: 27,45.5 28.5,47 28.5,56 25,59.5 25,77 14.5,87.5 5,87.5 3,89.5 3,100 10,107 10,132 24,146 U$1.18/A4/SDA | 27,45.5 47,45.5 64.5,63 74,63 77,60 GPIO2_RPI.. | 27,45.5 B1.LV1
5VSCL
  Top 0.152: U$2.A5 39,27 42,27 53,38 81,38 99.5,56.5 127.5,56.5 137.5,66.5 COMPASS.2
  Bottom 0.152: U$2.A5 38.5,27 28.5,37 28.5,51.5 24.5,55.5 B1.HV2 | COMPASS.2 137.5,66.5 133,71 133,113 149,129 LCD_SCL1..
5VSDA  (via drill 0.35)
  Top 0.152: v31,36.5 31,32 38.5,24.5 U$2.A4 39,24.5 42,24.5 53,35.5 79.5,35.5 100,56 128,56 135,63 138.5,63 139,63.5 139,66 140,67 COMPASS.6 140,67.5 140,74.5 136.5,78 136.5,115.5 147.5,126.5 149,126.5 LCD_SDA1..
  Bottom 0.152: v31,36.5 29,38.5 29,53 27,55 B1.HV1
+3V3
  Top 0.152: D2.A 11.5,71 11.5,55.5 21.5,45.5 B1.LV 22,45 23.5,43.5 27.5,43.5 29,45 64.5,45 74.5,55 74.5,59.5 3V3_RPI..
+5V
  Bottom 0.152: LDR_5V+.. 77.5,67.5 77.5,75 80,77.5 80,78 78,80 ULTRA1.1
  pour Route3 (isolate 0.012, rank 3, no thermals): 0,152 152,152 152,0 0,0
+12V  (via drill 0.35)
  Bottom 0.152: LED_12V+.. 72,67 62.5,67 62,66.5 57.5,66.5 51,73 34.5,73 BOOSTER_+12V.. | v78,64 78.5,64 85.5,57 103.5,57 105,58.5 121,58.5 5V/3A_IN+2..
  pour Route3 (isolate 0.012, rank 2, no thermals): 27,70 40,70 40,85 15,85 15,70
  pour Route3 (isolate 0.012, no thermals): 69,71 69,62 78,62 78,71
  pour Route3 (isolate 0.012, no thermals): 117,65 117,56 126,56 126,65
+24V  (via drill 0.35)
  Top 0.152: v71,86.5 73,86.5 123,136.5 123,138 PAD3.P$1
  Bottom 0.152: v71,86.5 40.5,86.5 27.5,73.5 26.5,73.5 BOOSTER_+24V..
  pour Route3 (isolate 0.012, no thermals): 21,76 21,67 30,67 30,76
  pour Route3 (isolate 0.012, no thermals): 117,144 117,135 126,135 126,144
BATT+  (via drill 0.35)
  Top 0.152: SWITCH_+2.. 124.5,78 103.5,57 99,57 82.5,40.5 v11.5,40.5
  Bottom 0.152: SUPPLY_+.. 5,118 19,104 19,79 17.5,77.5 SWITCH_+1.. 17,77 17,73 11.5,67.5 v11.5,40.5
  pour Route3 (isolate 0.012, rank 2, no thermals): 128,83 128,74 137,74 137,83
  pour Route3 (isolate 0.012, no thermals): 2,116 12,116 12,126 2,126
DRIVER+
  Top 0.152: DRIBBLER_+12V2.. 45.5,124 38.5,124 13.5,99 5.5,99 DRIVER_+12V1_1.. | DRIVER_+12V4_2.. 147.5,29 124.5,29 123,30.5 78,30.5 55,7.5 8.5,7.5 5,11 DRIVER_+12V2_2..
  Bottom 0.152: SWITCH_ACC2.. 135,82 136.5,83.5 | 136.5,83.5 138,85 138,102 147,111 DRIVER_+12V3_1.. | 136.5,83.5 136.5,78 139,75.5 139,61 147.5,52.5 147.5,29 DRIVER_+12V4_2.. | DRIVER_+12V2_1.. 5,14 5,24.5 10.5,30 10.5,69 12.5,71 12.5,74 15.5,77 15.5,86 5.5,96 DRIVER_+12V1_2..
  pour Route3 (isolate 0.012, no thermals): 43,126 43,117 52,117 52,126
  pour Route3 (isolate 0.012, no thermals): 3,102 3,93 12,93 12,102
  pour Route3 (isolate 0.012, no thermals): 141,116 141,107 150,107 150,116
  pour Route3 (isolate 0.012, no thermals): 140,32 140,23 149,23 149,32
  pour Route3 (isolate 0.012, no thermals): 1,17 1,8 10,8 10,17
  pour Route3 (isolate 0.012, no thermals): 137,79 128,79 128,86 137,86
GND
  pour Route2 (isolate 0.012, no thermals): 0,152 152,152 152,0 0,0
N$1
  Bottom 0.152: LDR1.6 93.5,65.5 93.5,74.5 69.5,98.5 69.5,114.5 71,116 71,134.5 63.5,142 63.5,147 63,147.5 48,147.5 47,146.5 U$1.39/A20
N$2
  Bottom 0.152: U$1.9/CS 29.5,131 29.5,129.5 59,100 60,100 61,99 DRIBBLER_DIR..
N$3
  Bottom 0.152: U$1.5 19,131.5 20,131.5 21,132.5 27,132.5 28,131.5 28,129.5 58.5,99 DRIBBLER_PWM..
N$4
  Bottom 0.152: U$1.2 11.5,131 21.5,121 21.5,118.5 30.5,109.5 DRIVER_PWM1..
N$5  (via drill 0.35)
  Top 0.152: v13.5,127.5 13.5,131 U$1.3/CANTX | v30,39.5 30,31.5 31.5,30 31.5,25 30.5,24 DRIVER_PWM2..
  Bottom 0.152: v13.5,127.5 13.5,116 24.5,105 24.5,60 30,54.5 v30,39.5
N$6
  Top 0.152: LDR1.2 93,63 101.5,71.5 101.5,73.5 125.5,97.5 125.5,146 124.5,147 74.5,147 68.5,141 65.5,141 61,145.5 61,146.5 60,147.5 28,147.5 27,146.5 U$1.17/A3
N$7  (via drill 0.35)
  Top 0.152: v72.5,140.5 35,140.5 29.5,146 U$1.16/A2
  Bottom 0.152: v72.5,140.5 72.5,129.5 95.5,106.5 95.5,64.5 95,64 95,63 LDR1.3
N$8
  Bottom 0.152: LDR1.4 89.5,65 90.5,64 94,64 95,65 95,106 72,129 72,135.5 64.5,143 64.5,148 64,148.5 34,148.5 32,146.5 U$1.15/A1
N$9  (via drill 0.35)
  Top 0.152: v93,76.5 93,68 91.5,66.5 91.5,65.5 LDR1.5
  Bottom 0.152: v93,76.5 93,107 71.5,128.5 71.5,135 64,142.5 64,147.5 63.5,148 36,148 34.5,146.5 U$1.14/A0
N$10  (via drill 0.35)
  Top 0.152: v73.5,134.5 32,134.5 v31.5,134
  Bottom 0.152: v73.5,134.5 73.5,129.5 96,107 96,62.5 95,61.5 91.5,61.5 90.5,62.5 LDR1.1 | v31.5,134 19,146.5 U$1.20/A6
N$11  (via drill 0.35)
  Top 0.152: v75,130 74.5,129.5 38,129.5 28,119.5 20,119.5 16.5,123 16.5,131 U$1.4/CANRX
  Bottom 0.152: v75,130 78.5,130 89.5,119 104,119 121.5,101.5 DRIVER_PWM3..
N$12
  Top 0.152: MOSFET_DRAIN.. 28,118.5 38.5,129 104,129 SOLENOID-.. 119.5,144.5 123,144.5 PAD4.P$1
N$13  (via drill 0.35)
  Top 0.152: v39.5,46.5 39.5,69.5 14,95 4.5,95 3.5,96 3.5,99.5 22,118 25,118 MOSFET_GATE.. | v102,133.5 32.5,133.5 30.5,131.5 v30.5,125.5
  Bottom 0.152: v39.5,46.5 54,32 U$2.D2 | v102,133.5 114,133.5 126,145.5 128,145.5 R1.P$2 | v30.5,125.5 30.5,123.5 25.5,118.5 MOSFET_GATE..
N$14  (via drill 0.35)
  Top 0.152: v20.5,68.5 18,68.5 14,72.5 10.5,72.5 3,65 3,11 9,5 66.5,5 77.5,16 122,16 DRIVER_PWM4..
  Bottom 0.152: v20.5,68.5 20.5,108 10,118.5 10,145 11,146 U$1.23/A9
N$15
  Bottom 0.152: U$1.22/A8 13.5,146.5 12.5,147.5 8,147.5 7.5,147 7.5,120 19.5,108 19.5,63 12.5,56 12.5,26.5 35,4 65.5,4 70.5,9 117.5,9 122,13.5 DRIVER_DIR4..
N$16
  Top 0.152: C5.1 83,126.5 83,121.5 64,102.5 64,99 DRIBBLER_CAP-..
N$17
  Bottom 0.152: U$1.6 22,131 22,119.5 29.5,112 30.5,112 DRIVER_DIR1..
N$18  (via drill 0.35)
  Top 0.152: v53.5,89 53.5,66.5 57,63 58,63 LDR2.1 | v40,116 40,117.5 v44,121.5
  Bottom 0.152: v53.5,89 40,102.5 v40,116 | v44,121.5 44,129.5 43,130.5 43,134.5 49,140.5 49,146 U$1.38/A19
N$19  (via drill 0.35)
  Top 0.152: v57,120.5 44,107.5 44,75 57.5,61.5 59.5,61.5 60.5,62.5 LDR2.2
  Bottom 0.152: v57,120.5 57,126.5 61,130.5 61,137 52,146 U$1.37/A18
N$20  (via drill 0.35)
  Top 0.152: v61.5,126 61,126 43.5,108.5 43.5,74.5 57,61 61,61 62.5,62.5 LDR2.3
  Bottom 0.152: v61.5,126 61.5,128.5 63.5,130.5 63.5,137 54.5,146 U$1.36/A17
N$21  (via drill 0.35)
  Top 0.152: v58,67.5 57.5,67 57.5,65.5 LDR2.4
  Bottom 0.152: v58,67.5 58,74 69.5,85.5 71.5,85.5 72,86 72,88 66.5,93.5 66.5,115.5 65.5,116.5 65.5,138 57.5,146 U$1.35/A16
N$22  (via drill 0.35)
  Top 0.152: v55,87.5 55,66 57,64 58,64 59,65 LDR2.5 | v60.5,141.5 60.5,145.5 60,146 U$1.34/A15
  Bottom 0.152: v55,87.5 66,98.5 66,115 65,116 65,137 v60.5,141.5
N$23
  Bottom 0.152: LDR2.6 62,65.5 80,65.5 84.5,70 84.5,76.5 69,92 69,115 70.5,116.5 70.5,134 62.5,142 62.5,146 U$1.33/A14
N$24  (via drill 0.35)
  Top 0.152: v20.5,120.5 24,124 24,131 U$1.7
  Bottom 0.152: v20.5,120.5 20.5,110 25,105.5 25,60.5 38.5,47 38.5,45 41,42.5 41,26.5 40,25.5 36,25.5 31,30.5 29.5,30.5 28.5,29.5 28.5,28 30,26.5 DRIVER_DIR2..
N$25
  Top 0.152: U$1.8 27,131.5 35,139.5 112.5,139.5 119.5,146.5 124,146.5 125,145.5 125,102 122,99 DRIVER_DIR3..
N$26  (via drill 0.35)
  Top 0.152: v84.5,45.5 84.5,58.5 83.5,59.5 83.5,68.5 87,72 87,77 85,79 76.5,79 75.5,80 ULTRA1.2
  Bottom 0.152: v84.5,45.5 84.5,36.5 54.5,6.5 U$2.D12
N$27
  Top 0.152: C5.2 78,126.5 72.5,126.5 46,100 46,99 DRIBBLER_CAP+..
N$28  (via drill 0.35)
  Top 0.152: v81.5,50 81.5,68 77,72.5 77,77.5 ULTRA1.5
  Bottom 0.152: v81.5,50 81.5,47 79.5,45 79.5,34 54.5,9 U$2.D11
N$29
  Bottom 0.152: U$2.D10 54,11 52,9 52,6 53,5 55.5,5 85.5,35 85.5,56 78.5,63 77.5,63 77,63.5 77,64.5 77.5,65 80.5,65 87,71.5 87,74.5 88,75.5 ULTRA2.2
N$30  (via drill 0.35)
  Top 0.152: v76,41.5 83,48.5 83,69.5 84.5,71 84.5,73 85.5,74 ULTRA2.5
  Bottom 0.152: v76,41.5 76,35.5 54.5,14 U$2.D9
N$31
  Top 0.152: C1.1 108,127 104.5,127 103,128.5 55,128.5 45,118.5 44,118.5 40,114.5 40,111 38,109 36,109 31,114 DRIVER_CAP-1..
N$32
  Top 0.152: C1.2 102.5,127 101.5,127 100.5,128 62,128 30.5,96.5 DRIVER_CAP+1..
N$33  (via drill 0.35)
  Top 0.152: v100,118 100,126.5 C2.1
  Bottom 0.152: v100,118 100,85 123,62 123,58 74.5,9.5 67,9.5 62,4.5 51,4.5 40.5,15 38,15 31.5,21.5 31.5,28 30.5,29 DRIVER_CAP-2..
N$34  (via drill 0.35)
  Top 0.152: v129,55.5 100.5,55.5 57.5,12.5 31.5,12.5 30.5,11.5 DRIVER_CAP+2..
  Bottom 0.152: v129,55.5 129,116 117,128 99,128 98,127 95,127 C2.2
N$35
  Bottom 0.152: C3.1 92,126.5 93,126.5 99.5,120 118.5,120 123.5,115 123.5,98 122,96.5 DRIVER_CAP-3..
N$36
  Bottom 0.152: C3.2 86.5,126.5 90,126.5 97,119.5 118,119.5 121.5,116 121.5,114 DRIVER_CAP+3..
N$37
  Bottom 0.152: C4.1 116.5,126.5 116.5,124 128,112.5 128,54.5 129,53.5 129,18 122.5,11.5 DRIVER_CAP-4..
N$38
  Bottom 0.152: C4.2 111.5,126.5 113,126.5 124,115.5 124,30.5 122.5,29 DRIVER_CAP+4..
N$39
  Bottom 0.152: U$2.D8 54.5,16.5 56.5,18.5 56.5,20.5 75,39 75,44 76.5,45.5 ULTRA3.2
N$40
  Bottom 0.152: U$2.D7 54.5,19.5 73,38 73,46 75,48 ULTRA3.5
N$41  (via drill 0.35)
  Top 0.152: v56,66.5 56,67.5 62.5,74 63.5,74 ULTRA4.2
  Bottom 0.152: v56,66.5 56,65 56.5,64.5 56.5,31.5 55.5,30.5 53,30.5 52,29.5 52,24 54,22 U$2.D6
N$42  (via drill 0.35)
  Top 0.152: v65.5,64 65.5,72.5 65,73 65,74.5 66,75.5 ULTRA4.5
  Bottom 0.152: v65.5,64 63.5,62 63.5,33.5 54.5,24.5 U$2.D5

### Text on the board
tPlace: ON MOTOR | ON ALL | BATTERY
bPlace: OUT- | IN- | OUT+ | IN+ | Made by: 2 of us lah | USB
tDocu: DRIBBLER | DRIVER1 | DRIVER3 | DRIVER2 | DRIVER4